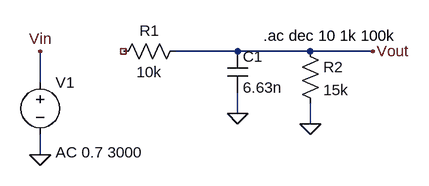
[diagram p0: schematic RCLP.asc]
RCLP.asc, the LTspice schematic file:
Version 4.1
SHEET 1 880 680
WIRE 336 -32 240 -32
WIRE 448 -32 336 -32
WIRE 544 -32 448 -32
WIRE 32 16 32 -32
WIRE 336 64 336 32
WIRE 448 80 448 48
WIRE 32 128 32 96
FLAG 32 128 0
FLAG 336 64 0
FLAG 448 80 0
FLAG 32 -32 Vin
FLAG 544 -32 Vout
SYMBOL voltage 32 0 R0
WINDOW 123 24 124 Left 2
WINDOW 39 0 0 Left 0
SYMATTR InstName V1
SYMATTR Value ""
SYMATTR Value2 AC 0.7 3000
SYMBOL cap 320 -32 R0
SYMATTR InstName C1
SYMATTR Value 6.63n
SYMBOL res 432 -48 R0
SYMATTR InstName R2
SYMATTR Value 15k
SYMBOL res 256 -48 R90
WINDOW 0 0 56 VBottom 2
WINDOW 3 32 56 VTop 2
SYMATTR InstName R1
SYMATTR Value 10k
TEXT 376 -56 Left 2 !.ac dec 10 1k 100k

The netlist it stands for:
* RCLP.asc
V1 Vin 0 AC 0.7 3000
C1 Vout 0 6.63n
R2 Vout 0 15k
R1 Vout NC_01 10k
.ac dec 10 1k 100k
.backanno
.end